# Altium schematic sheet DISCRETE_IF.SchDoc: {Наименование}
size 420 x 297 mm; ApprovedBy: {Утвердил}; CheckedBy: {Проверил}; DrawnBy: {Разраб.}; DocumentNumber: АБВГ 123456.789 00; SheetNumber: 8; SheetTotal: {}; Scale: {Мш.}; PageSetup: Record=PageOptions|CenterHorizontal=False|CenterVertical=False|PrintScale=0.95|XCorrection=0.00|YCorrection=0.00|PrintKind=1|BorderSize=5000000|LeftOffset=0|BottomOffset=0|Orientation=1|PaperLength=1000|PaperWidth=1000|Scale=100|PaperSource=15|PrintQuality=600|MediaType=1|DitherType=10|PaperKind=A4|PrintScaleMode=1; ProcessInspection: {Т.контр.}; Mass: {М.}; NormInspection: {Н.контр.}; Letter1Column: {}; Letter2Column: {}; Letter3Column: {}; DocumentType: {Документ}; Rule: PcbType=ProtelPcb
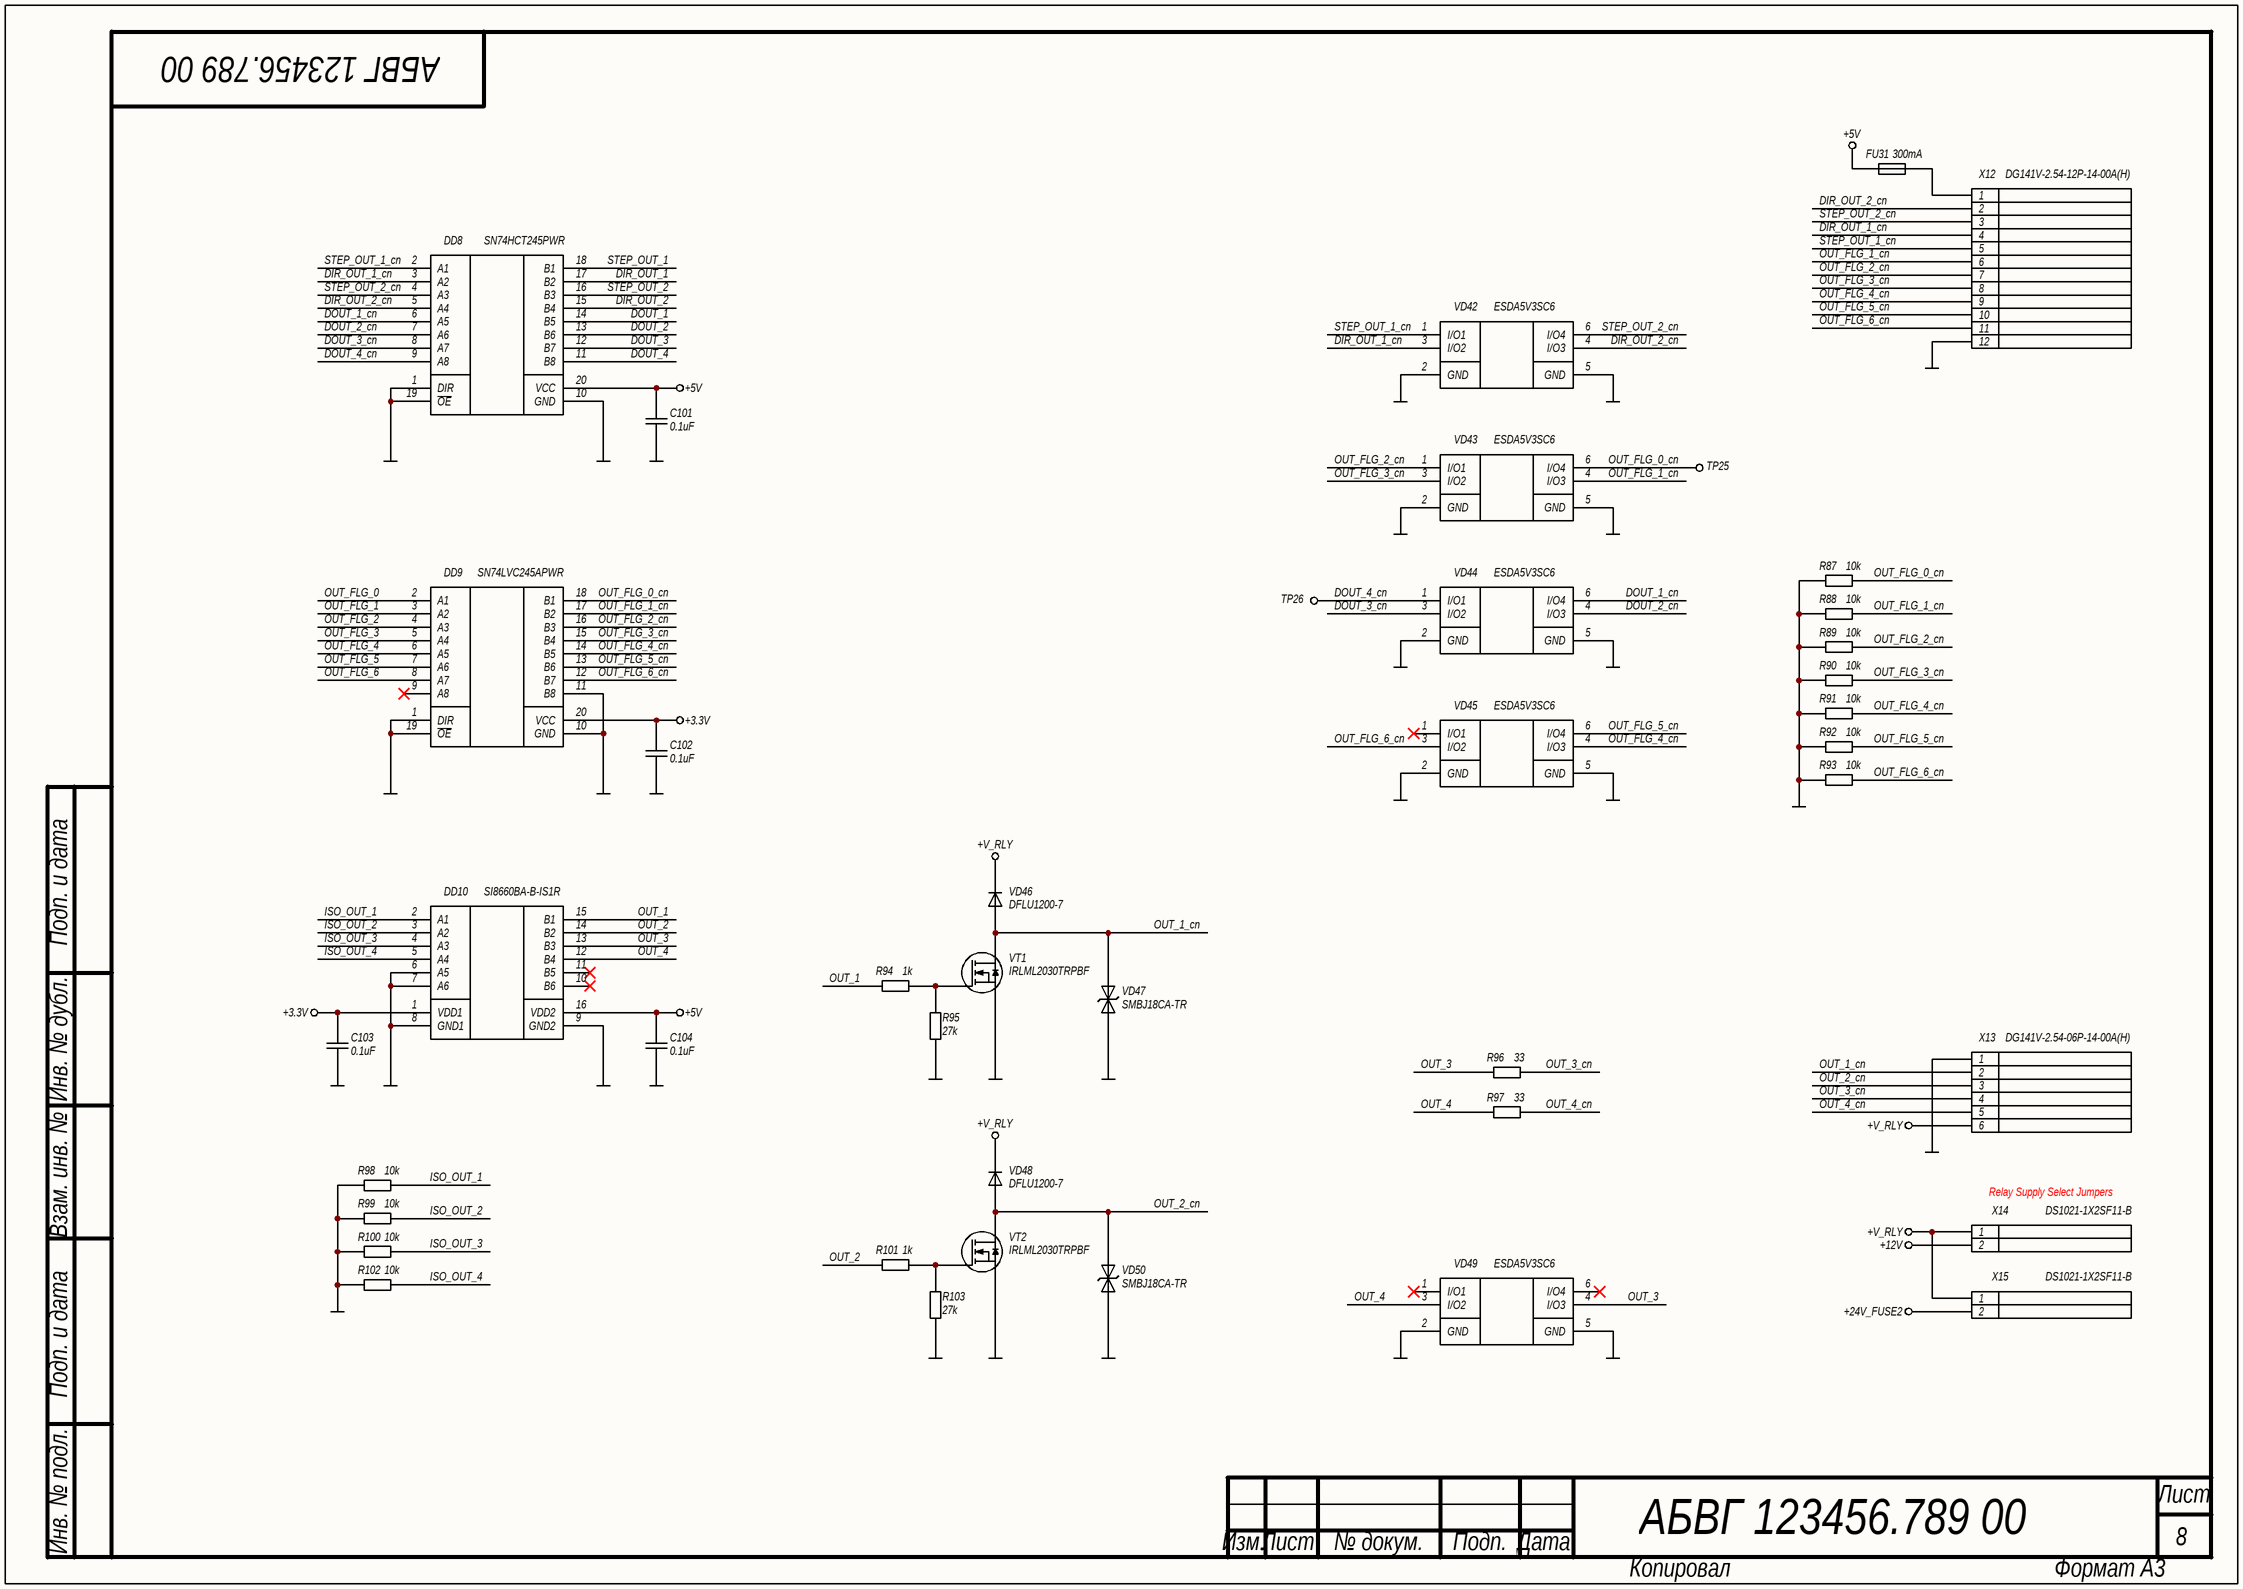
[diagram p0: DISCRETE_IF.SchDoc]

## Parts
C101  0.1uF  [C0603N]
C102  0.1uF  [C0603N]
C103  0.1uF  [C0603N]
C104  0.1uF  [C0603N]
DD8  SN74HCT245PWR  [TSSOP20]
DD9  SN74LVC245APWR  [TSSOP20]
DD10  SI8660BA-B-IS1R  [SOIC16]
FU31  300mA  [MF-MSMF]
R87  10k  [R0603N]
R88  10k  [R0603N]
R89  10k  [R0603N]
R90  10k  [R0603N]
R91  10k  [R0603N]
R92  10k  [R0603N]
R93  10k  [R0603N]
R94  1k  [R0603N]
R95  27k  [R0603N]
R96  33  [R0603N]
R97  33  [R0603N]
R98  10k  [R0603N]
R99  10k  [R0603N]
R100  10k  [R0603N]
R101  1k  [R0603N]
R102  10k  [R0603N]
R103  27k  [R0603N]
TP25  TEST_POINT  [TP_HOLE_1MM_1.5MM]  (value not drawn)  (no BOM)
TP26  TEST_POINT  [TP_HOLE_1MM_1.5MM]  (value not drawn)  (no BOM)
VD42  ESDA5V3SC6  [SOT23-6]
VD43  ESDA5V3SC6  [SOT23-6]
VD44  ESDA5V3SC6  [SOT23-6]
VD45  ESDA5V3SC6  [SOT23-6]
VD46  DFLU1200-7  [PowerDI123]
VD47  SMBJ18CA-TR  [SMB]
VD48  DFLU1200-7  [PowerDI123]
VD49  ESDA5V3SC6  [SOT23-6]
VD50  SMBJ18CA-TR  [SMB]
VT1  IRLML2030TRPBF  [SOT23]
VT2  IRLML2030TRPBF  [SOT23]
X12  DG141V-2.54-12P-14-00A(H)  [DG141V-2.54-12P-14-00A(H)]
X13  DG141V-2.54-06P-14-00A(H)  [DG141V-2.54-06P-14-00A(H)]
X14  DS1021-1X2SF11-B  [2.54_2X1_HEADER]
X15  DS1021-1X2SF11-B  [2.54_2X1_HEADER]

## Nets
+3.3V: C102.2 C103.2 DD9.20(VCC) DD10.1(VDD1)
+5V: C101.2 C104.2 DD8.20(VCC) DD10.16(VDD2) FU31.1
+12V: X14.2
+24V_FUSE2: X15.2
+V_RLY: VD46.1(K) VD48.1(K) X13.6 X14.1 X15.1
GND: C101.1 C102.1 C103.1 C104.1 DD8.1(DIR) DD8.10(GND) DD8.19(~{OE}) DD9.1(DIR) DD9.10(GND) DD9.11(B8) DD9.19(~{OE}) DD10.6(A5) DD10.7(A6) DD10.8(GND1) DD10.9(GND2) R87.2 R88.2 R89.2 R90.2 R91.2 R92.2 R93.2 R95.1 R98.2 R99.2 R100.2 R102.2 R103.1 VD42.2(GND) VD42.5(GND) VD43.2(GND) VD43.5(GND) VD44.2(GND) VD44.5(GND) VD45.2(GND) VD45.5(GND) VD47.2(A2) VD49.2(GND) VD49.5(GND) VD50.2(A2) VT1.2(S) VT2.2(S) X12.12 X13.1
DIR_OUT_1: DD8.17(B2)
DIR_OUT_1_cn: DD8.3(A2) VD42.3(I/O2) X12.4
DIR_OUT_2: DD8.15(B4)
DIR_OUT_2_cn: DD8.5(A4) VD42.4(I/O3) X12.2
DOUT_1: DD8.14(B5)
DOUT_1_cn: DD8.6(A5) VD44.6(I/O4)
DOUT_2: DD8.13(B6)
DOUT_2_cn: DD8.7(A6) VD44.4(I/O3)
DOUT_3: DD8.12(B7)
DOUT_3_cn: DD8.8(A7) VD44.3(I/O2)
DOUT_4: DD8.11(B8)
DOUT_4_cn: DD8.9(A8) TP26.1 VD44.1(I/O1)
ISO_OUT_1: DD10.2(A1) R98.1
ISO_OUT_2: DD10.3(A2) R99.1
ISO_OUT_3: DD10.4(A3) R100.1
ISO_OUT_4: DD10.5(A4) R102.1
OUT_1: DD10.15(B1) R94.2
OUT_1_cn: VD46.2(A) VD47.1(A1) VT1.3(D) X13.2
OUT_2: DD10.14(B2) R101.2
OUT_2_cn: VD48.2(A) VD50.1(A1) VT2.3(D) X13.3
OUT_3: DD10.13(B3) R96.2 VD49.4(I/O3)
OUT_3_cn: R96.1 X13.4
OUT_4: DD10.12(B4) R97.2 VD49.3(I/O2)
OUT_4_cn: R97.1 X13.5
OUT_FLG_0: DD9.2(A1)
OUT_FLG_0_cn: DD9.18(B1) R87.1 TP25.1 VD43.6(I/O4)
OUT_FLG_1: DD9.3(A2)
OUT_FLG_1_cn: DD9.17(B2) R88.1 VD43.4(I/O3) X12.6
OUT_FLG_2: DD9.4(A3)
OUT_FLG_2_cn: DD9.16(B3) R89.1 VD43.1(I/O1) X12.7
OUT_FLG_3: DD9.5(A4)
OUT_FLG_3_cn: DD9.15(B4) R90.1 VD43.3(I/O2) X12.8
OUT_FLG_4: DD9.6(A5)
OUT_FLG_4_cn: DD9.14(B5) R91.1 VD45.4(I/O3) X12.9
OUT_FLG_5: DD9.7(A6)
OUT_FLG_5_cn: DD9.13(B6) R92.1 VD45.6(I/O4) X12.10
OUT_FLG_6: DD9.8(A7)
OUT_FLG_6_cn: DD9.12(B7) R93.1 VD45.3(I/O2) X12.11
STEP_OUT_1: DD8.18(B1)
STEP_OUT_1_cn: DD8.2(A1) VD42.1(I/O1) X12.5
STEP_OUT_2: DD8.16(B3)
STEP_OUT_2_cn: DD8.4(A3) VD42.6(I/O4) X12.3
NetFU31_2: FU31.2 X12.1
NetR94_1: R94.1 R95.2 VT1.1(G)
NetR101_1: R101.1 R103.2 VT2.1(G)

Not connected (* = marked no-connect by the designer): DD9 9(A8)*; DD10 10(B6)* 11(B5)*; VD45 1(I/O1)*; VD49 1(I/O1)* 6(I/O4)*

## Notes on the sheet
- (near X14) Relay Supply Select Jumpers
- Подп. и дата
- Инв. № дубл.
- Взам. инв. №
- Инв. № подл.
- Лист
- Изм.
- № докум.
- Подп.
- Дата
- Копировал
- Формат А3

## Library data of the parts
C101-C104 = CL10B104KB8NNNC: Конденсатор; Точность: 10%; Напряжение: 50V; Диэлектрик: X7R; Производитель: Samsung Electro-Mechanics; Описание: 0.1 µF ±10% 50V Ceramic Capacitor X7R 0603 (1608 Metric); Корпус: 0603 (1608 Metric); Температурный диапазон: -55°C ~ 125°C; Вид монтажа: SMD; Артикул: CL10B104KB8NNNC; Номинал: 0.1uF; Строка для документации: https://mm.digikey.com/Volume0/opasdata/d220001/medias/docus/609/CL10B104KB8NNNC_Spec.pdf; Тип элемента: Конденсатор
DD8 = SN74HCT245PWR: Микросхема шинный формирователь; Производитель: Texas Instruments; Описание: Transceiver, Non-Inverting 1 Element 8 Bit per Element 3-State Output 20-TSSOP; Корпус: 20-TSSOP (0.173", 4.40mm Width); Температурный диапазон: -40°C ~ 85°C (TA); Вид монтажа: SMD; Артикул: SN74HCT245PWR; Строка для документации: https://www.ti.com/lit/ds/symlink/sn74hct245.pdf; Тип элемента: Микросхема
DD9 = SN74LVC245APWR: Микросхема шинный формирователь; Производитель: Texas Instruments; Описание: Transceiver, Non-Inverting 1 Element 8 Bit per Element 3-State Output 20-TSSOP; Корпус: 20-TSSOP (0.173", 4.40mm Width); Температурный диапазон: -40°C ~ 125°C (TA); Вид монтажа: SMD; Артикул: SN74LVC245APWR; Строка для документации: https://www.ti.com/lit/ds/scas218x/scas218x.pdf; Тип элемента: Микросхема
DD10 = SI8660BA-B-IS1R: Микросхема цифровой изолятор; Производитель: Skyworks Solutions Inc.; Описание: General Purpose Digital Isolator 1000Vrms 6 Channel 150Mbps 35kV/µs CMTI 16-SOIC (0.154", 3.90mm Width); Корпус: 16-SOIC (0.154", 3.90mm Width); Температурный диапазон: -40°C ~ 125°C; Вид монтажа: SMD; Артикул: SI8660BA-B-IS1R; Строка для документации: https://www.skyworksinc.com/-/media/Skyworks/SL/documents/public/data-sheets/Si866x.pdf; Тип элемента: Микросхема
FU31 = MF-MSMF030-2: Плавкий предохранитель; Напряжение: 30V; Тип: PTC Resettable Fuse; Производитель: Bourns Inc.; Описание: Polymeric PTC Resettable Fuse 30V 300 mA Ih Surface Mount 1812 (4532 Metric), Concave; Корпус: 1812 (4532 Metric), Concave; Температурный диапазон: -40°C ~ 85°C; Вид монтажа: SMD; Артикул: MF-MSMF030-2; Ток: 300mA; Строка для документации: https://www.bourns.com/docs/product-datasheets/mf-msmf.pdf; Тип элемента: Предохранитель
R87-R93 R98-R100 R102 = RC0603FR-0710KL: Резистор; Точность: 1%; ТКС: ±100ppm/°C; Напряжение: 75V; Производитель: YAGEO; Описание: 10 kOhms ±1% 0.1W, 1/10W Chip Resistor 0603 (1608 Metric) Moisture Resistant Thick Film; Корпус: 0603 (1608 Metric); Температурный диапазон: -55°C ~ 155°C; Вид монтажа: SMD; Артикул: RC0603FR-0710KL; Номинал: 10k; Строка для документации: https://www.yageo.com/upload/media/product/app/datasheet/rchip/pyu-rc_group_51_rohs_l.pdf; Тип элемента: Резистор
R94 R101 = RC0603JR-071KL: Резистор; Точность: 5%; ТКС: ±100ppm/°C; Напряжение: 75V; Производитель: YAGEO; Описание: 1 kOhms ±5% 0.1W, 1/10W Chip Resistor 0603 (1608 Metric) Moisture Resistant Thick Film; Корпус: 0603 (1608 Metric); Температурный диапазон: -55°C ~ 155°C; Вид монтажа: SMD; Артикул: RC0603JR-071KL; Номинал: 1k; Строка для документации: https://www.yageo.com/upload/media/product/app/datasheet/rchip/pyu-rc_group_51_rohs_l.pdf; Тип элемента: Резистор
R95 R103 = RC0603FR-0727KL: Резистор; Точность: 1%; ТКС: ±100ppm/°C; Напряжение: 75V; Производитель: YAGEO; Описание: 27 kOhms Jumper Chip Resistor 0603 (1608 Metric) Moisture Resistant Thick Film; Корпус: 0603 (1608 Metric); Температурный диапазон: -55°C ~ 155°C; Вид монтажа: SMD; Артикул: RC0603FR-0727KL; Номинал: 27k; Строка для документации: https://www.yageo.com/upload/media/product/app/datasheet/rchip/pyu-rc_group_51_rohs_l.pdf; Тип элемента: Резистор
R96 R97 = RC0603FR-0733RL: Резистор; Точность: 1%; ТКС: ±100ppm/°C; Напряжение: 75V; Производитель: YAGEO; Описание: 33 Ohms ±1% 0.1W, 1/10W Chip Resistor 0603 (1608 Metric) Moisture Resistant Thick Film; Корпус: 0603 (1608 Metric); Температурный диапазон: -55°C ~ 155°C; Вид монтажа: SMD; Артикул: RC0603FR-0733RL; Номинал: 33; Строка для документации: https://www.yageo.com/upload/media/product/app/datasheet/rchip/pyu-rc_group_51_rohs_l.pdf; Тип элемента: Резистор
TP25 TP26 = Test Point, Round Pad/Hole 1.5mm/1.0mm diameter: Контрольная точка; Количество контактов: 1; Описание: Test Point, Round Pad/Hole, 1.5mm/1.0mm diameter; Тип элемента: Разъем; Артикул: Test Point, Round Pad/Hole 1.5mm/1.0mm diameter; Тип разъема: Test Point
VD42-VD45 VD49 = ESDA5V3SC6: Сборка TVS диодов, 4-канальная; Напряжение: 3V; Напряжение ограничения: 21V; Напряжение пробоя: 5.3V; Ток: 22A; Тип: TVS Unidirectional; Производитель: STMicroelectronics; Описание: Clamp Ipp Tvs Diode Surface Mount SOT-23-6; Корпус: SOT-23-6; Температурный диапазон: -40°C ~ 150°C (TJ); Вид монтажа: SMD; Тип элемента: Диод защитный; Артикул: ESDA5V3SC6; Строка для документации: https://www.st.com/content/ccc/resource/technical/document/datasheet/7f/2e/1d/82/74/9c/4b/a1/CD00002055.pdf/files/CD00002055.pdf/jcr:content/translations/en.CD00002055.pdf
VD46 VD48 = DFLU1200-7: Диод; Прямой ток: 1A; Напряжение: 200V; Тип: Standard; Производитель: Diodes Incorporated; Описание: Diode 200 V 1A Surface Mount PowerDI™ 123; Корпус: PowerDI™ 123; Температурный диапазон: -65°C ~ 150°C; Вид монтажа: SMD; Артикул: DFLU1200-7; Строка для документации: https://www.diodes.com/assets/Datasheets/ds30601.pdf; Тип элемента: Диод
VD47 VD50 = SMBJ18CA-TR: TVS диод двунаправленный; Напряжение: 18V; Напряжение ограничения: 29.2V; Напряжение пробоя: 20V; Ток: 21.5A; Тип: TVS Bidirectional; Производитель: STMicroelectronics; Описание: 29.2V Clamp 21.5A Ipp Tvs Diode Surface Mount SMB (DO-214AA); Корпус: DO-214AA, SMB; Температурный диапазон: -55°C ~ 150°C (TJ); Вид монтажа: SMD; Тип элемента: Диод защитный; Артикул: SMBJ18CA-TR; Строка для документации: https://www.st.com/content/ccc/resource/technical/document/datasheet/19/78/91/39/07/cd/40/65/CD00001366.pdf/files/CD00001366.pdf/_jcr_content/translations/en.CD00001366.pdf
VT1 VT2 = IRLML2030TRPBF: МОП транзистор, N-канальный; Ток: 2.7A; Напряжение: 30V; Сопротивление канала: 100m; Пороговое напряжение: 2.3V; Тип: N-MOSFET; Производитель: Infineon Technologies; Описание: N-Channel 30 V 2.7A (Ta) 1.3W (Ta) Surface Mount Micro3™/SOT-23; Корпус: SOT-23-3; Температурный диапазон: -55°C ~ 150°C (TJ); Вид монтажа: SMD; Тип элемента: Транзистор полевой; Артикул: IRLML2030TRPBF; Строка для документации: https://www.infineon.com/dgdl/irlml2030pbf.pdf?fileId=5546d462533600a401535664aef525ec
X12 = DG141V-2.54-12P-14-00A(H): Разъем, 12 контактов; Тип разъема: Push-Button terminal block; Количество контактов: 12; Шаг контактов: 2.54mm; Ток: 2A; Напряжение: 150V; Производитель: Degson Electronics; Описание: 12 Position Wire to Board Terminal Block Vertical with Board 0.100" (2.54mm) Through Hole; Температурный диапазон: -40°C ~ 105°C; Вид монтажа: Through Hole; Артикул: DG141V-2.54-12P-14-00A(H); Строка для документации: https://static.chipdip.ru/lib/874/DOC000874680.pdf; Тип элемента: Разъем
X13 = DG141V-2.54-06P-14-00A(H): Разъем, 6 контактов; Тип разъема: Push-Button terminal block; Количество контактов: 6; Шаг контактов: 2.54mm; Ток: 2A; Напряжение: 150V; Производитель: Degson Electronics; Описание: 6 Position Wire to Board Terminal Block Vertical with Board 0.100" (2.54mm) Through Hole; Температурный диапазон: -40°C ~ 105°C; Вид монтажа: Through Hole; Артикул: DG141V-2.54-06P-14-00A(H); Строка для документации: https://static.chipdip.ru/lib/874/DOC000874680.pdf; Тип элемента: Разъем
X14 X15 = DS1021-1X2SF11-B: Разъем, 2 контакта; Тип разъема: Header, Male Pin; Количество контактов: 2; Шаг контактов: 2.54mm; Ток: 3A; Напряжение: 250V; Производитель: Connfly electronic (Zhenqin); Описание: Connector Header Through Hole 2 position 0.100" (2.54mm); Температурный диапазон: -40°C ~ 105°C; Вид монтажа: Through Hole; Артикул: DS1021-1X2SF11-B; Строка для документации: http://cn.connfly.group/static/upload/file/pdf/DS1021.pdf; Тип элемента: Разъем